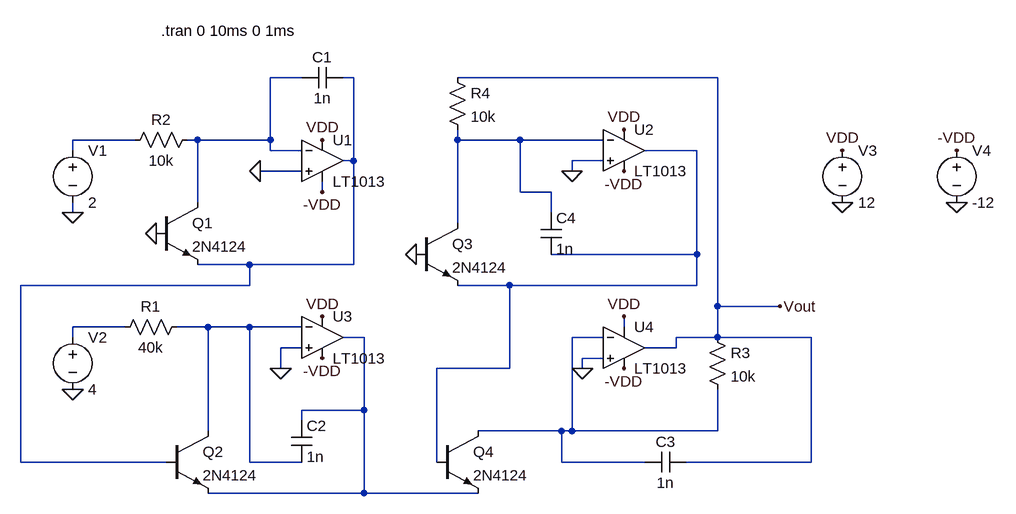
[diagram p0: schematic sqrt.asc]
sqrt.asc, the LTspice schematic file:
Version 4.1
SHEET 1 1076 680
WIRE 0 0 -48 0
WIRE 80 0 64 0
WIRE 640 0 240 0
WIRE -256 96 -352 96
WIRE -160 96 -176 96
WIRE -48 96 -48 0
WIRE -48 96 -160 96
WIRE 240 96 240 80
WIRE 336 96 240 96
WIRE 464 96 336 96
WIRE -352 112 -352 96
WIRE -48 112 -48 96
WIRE 0 112 -48 112
WIRE 608 112 528 112
WIRE 80 128 80 0
WIRE 80 128 64 128
WIRE 464 128 416 128
WIRE 0 144 -64 144
WIRE 416 144 416 128
WIRE 32 176 32 160
WIRE 336 176 336 96
WIRE 384 176 336 176
WIRE -160 192 -160 96
WIRE -352 208 -352 192
WIRE 384 208 384 176
WIRE 240 224 240 96
WIRE 608 272 608 112
WIRE 608 272 384 272
WIRE -80 288 -160 288
WIRE 80 288 80 128
WIRE 80 288 -80 288
WIRE -80 320 -80 288
WIRE -80 320 -432 320
WIRE 320 320 240 320
WIRE 608 320 608 272
WIRE 608 320 320 320
WIRE 640 352 640 0
WIRE 736 352 640 352
WIRE -272 384 -352 384
WIRE -144 384 -192 384
WIRE -80 384 -144 384
WIRE 0 384 -80 384
WIRE 496 384 496 368
WIRE -352 400 -352 384
WIRE 96 400 64 400
WIRE 464 400 416 400
WIRE 640 400 640 352
WIRE 640 400 576 400
WIRE 784 400 640 400
WIRE 0 416 -32 416
WIRE 576 416 576 400
WIRE 576 416 528 416
WIRE 464 432 432 432
WIRE -32 448 -32 416
WIRE 320 448 320 320
WIRE 320 448 208 448
WIRE 432 448 432 432
WIRE 96 512 96 400
WIRE 96 512 0 512
WIRE 0 528 0 512
WIRE -144 544 -144 384
WIRE 400 544 272 544
WIRE 416 544 416 400
WIRE 416 544 400 544
WIRE 640 544 640 480
WIRE 640 544 416 544
WIRE -432 592 -432 320
WIRE -208 592 -432 592
WIRE -80 592 -80 384
WIRE 0 592 -80 592
WIRE 208 592 208 448
WIRE 400 592 400 544
WIRE 528 592 400 592
WIRE 784 592 784 400
WIRE 784 592 592 592
WIRE 96 640 96 512
WIRE 96 640 -144 640
WIRE 272 640 96 640
FLAG -64 144 0
FLAG 416 144 0
FLAG 432 448 0
FLAG -32 448 0
FLAG -352 480 0
FLAG -352 208 0
FLAG -224 240 0
FLAG 176 272 0
FLAG 832 192 0
FLAG 1008 192 0
FLAG 832 112 VDD
FLAG 1008 112 -VDD
FLAG 496 368 VDD
FLAG 32 368 VDD
FLAG 496 80 VDD
FLAG 32 96 VDD
FLAG 32 176 -VDD
FLAG 496 144 -VDD
FLAG 496 448 -VDD
FLAG 32 432 -VDD
FLAG 736 352 Vout
SYMBOL OpAmps\\LT1013 32 64 R0
SYMATTR InstName U1
SYMBOL OpAmps\\LT1013 496 48 R0
SYMATTR InstName U2
SYMBOL OpAmps\\LT1013 32 336 R0
SYMATTR InstName U3
SYMBOL OpAmps\\LT1013 496 352 R0
SYMATTR InstName U4
SYMBOL voltage -352 96 R0
SYMATTR InstName V1
SYMATTR Value 2
SYMBOL voltage -352 384 R0
WINDOW 123 0 0 Left 0
WINDOW 39 0 0 Left 0
SYMATTR InstName V2
SYMATTR Value 4
SYMBOL res -176 368 R90
WINDOW 0 0 56 VBottom 2
WINDOW 3 32 56 VTop 2
SYMATTR InstName R1
SYMATTR Value 40k
SYMBOL res -160 80 R90
WINDOW 0 0 56 VBottom 2
WINDOW 3 32 56 VTop 2
SYMATTR InstName R2
SYMATTR Value 10k
SYMBOL npn -224 192 R0
SYMATTR InstName Q1
SYMATTR Value 2N4124
SYMBOL npn -208 544 R0
SYMATTR InstName Q2
SYMATTR Value 2N4124
SYMBOL npn 176 224 R0
SYMATTR InstName Q3
SYMATTR Value 2N4124
SYMBOL npn 208 544 R0
SYMATTR InstName Q4
SYMATTR Value 2N4124
SYMBOL res 624 384 R0
SYMATTR InstName R3
SYMATTR Value 10k
SYMBOL res 224 -16 R0
SYMATTR InstName R4
SYMATTR Value 10k
SYMBOL voltage 832 96 R0
WINDOW 123 0 0 Left 0
WINDOW 39 0 0 Left 0
SYMATTR InstName V3
SYMATTR Value 12
SYMBOL voltage 1008 96 R0
SYMATTR InstName V4
SYMATTR Value -12
SYMBOL cap 64 -16 R90
WINDOW 0 0 32 VBottom 2
WINDOW 3 32 32 VTop 2
SYMATTR InstName C1
SYMATTR Value 1n
SYMBOL cap -16 528 R0
SYMATTR InstName C2
SYMATTR Value 1n
SYMBOL cap 592 576 R90
WINDOW 0 0 32 VBottom 2
WINDOW 3 32 32 VTop 2
SYMATTR InstName C3
SYMATTR Value 1n
SYMBOL cap 368 208 R0
SYMATTR InstName C4
SYMATTR Value 1n
TEXT -216 -72 Left 2 !.tran 0 10ms 0 1ms

The netlist it stands for:
* sqrt.asc
X§U1 0 N001 VDD -VDD N002 LT1013  ; pins In+ In- V+ V- OUT
X§U2 0 N004 VDD -VDD N005 LT1013  ; pins In+ In- V+ V- OUT
X§U3 0 N007 VDD -VDD N008 LT1013  ; pins In+ In- V+ V- OUT
X§U4 0 N009 VDD -VDD Vout LT1013  ; pins In+ In- V+ V- OUT
V1 N003 0 2
V2 N006 0 4
R1 N007 N006 40k
R2 N001 N003 10k
Q1 N001 0 N002 0 2N4124
Q2 N007 N002 N008 0 2N4124
Q3 N004 0 N005 0 2N4124
Q4 N009 N005 N008 0 2N4124
R3 Vout N009 10k
R4 Vout N004 10k
V3 VDD 0 12
V4 -VDD 0 -12
C1 N002 N001 1n
C2 N008 N007 1n
C3 Vout N009 1n
C4 N004 N005 1n
.model NPN NPN
.model PNP PNP
.lib standard.bjt
.tran 0 10ms 0 1ms
.lib LTC.lib
.backanno
.end